# EAGLE design pcb_schematic (EAGLE 7.5.0)
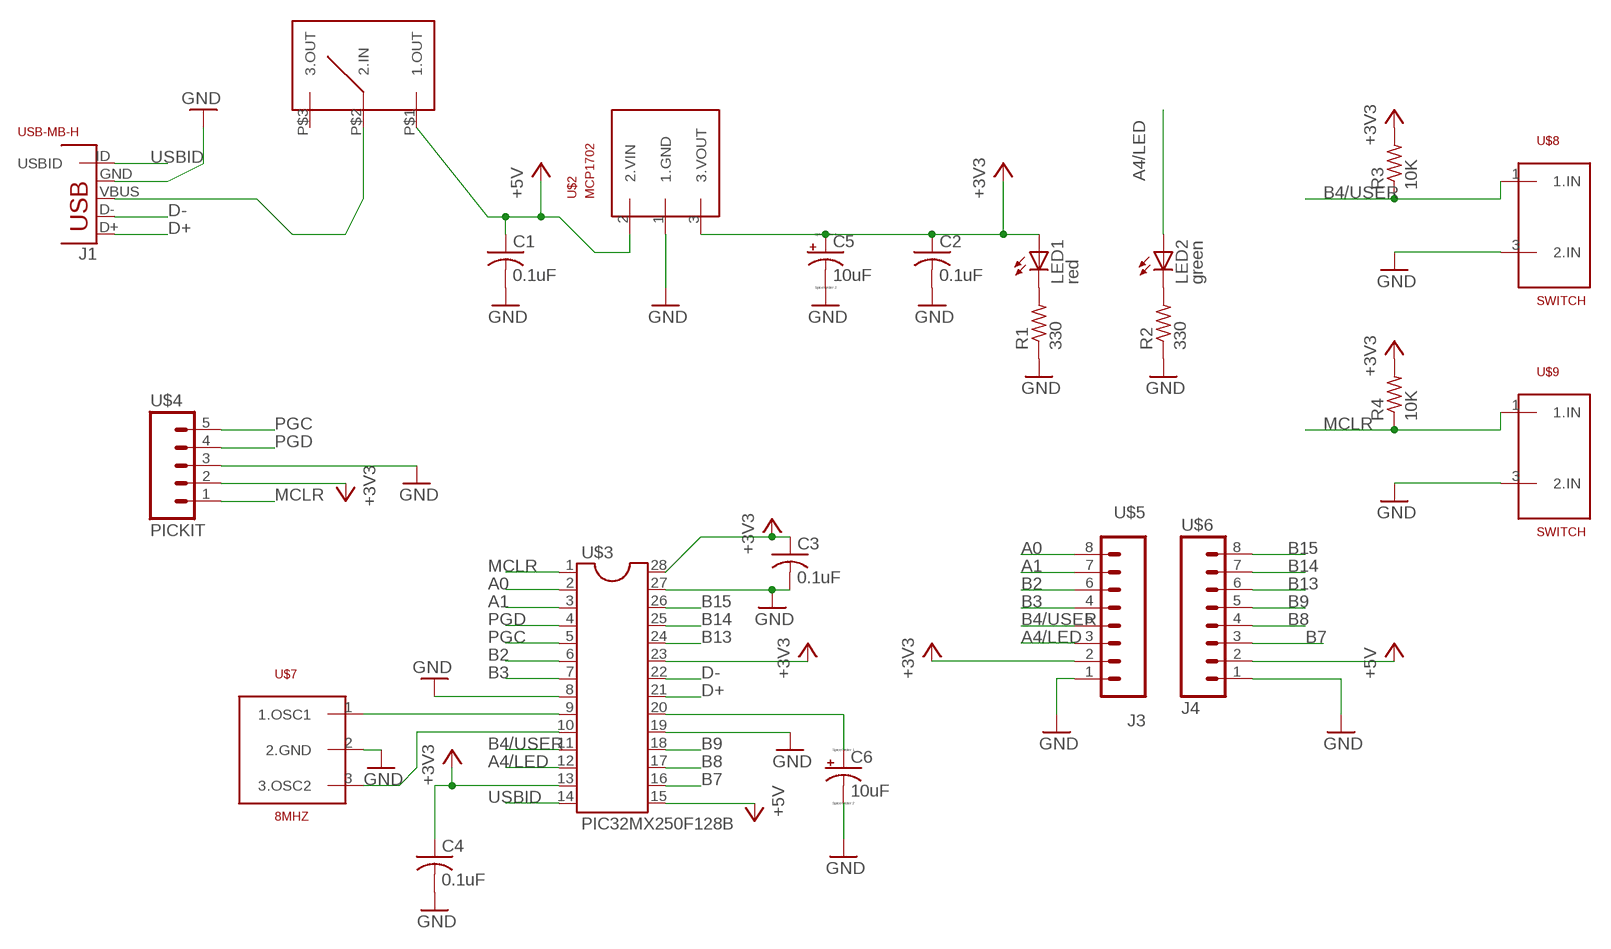
[diagram p0: schematic, sheet 1]

## Parts
C1  0.1uF  C-US025-025X050  [C025-025X050]
C2  0.1uF  C-US025-025X050  [C025-025X050]
C3  0.1uF  C-US025-025X050  [C025-025X050]
C4  0.1uF  C-US025-025X050  [C025-025X050]
C5  10uF  CPOL-USB45181A  [B45181A]
C6  10uF  CPOL-USB45181A  [B45181A]
J1  USB-MB-H  [USB-MB-H]
LED1  red  LED3MM  [LED3MM]
LED2  green  LED3MM  [LED3MM]
R1  330  R-US_0204/7  [0204/7]
R2  330  R-US_0204/7  [0204/7]
R3  10K  R-US_0204/7  [0204/7]
R4  10K  R-US_0204/7  [0204/7]
U$1  SLIDE_SWITCH  [SLIDE_SWITCH]
U$2  MCP1702  [TO92]
U$3  PIC32MX250F128B  [PIC32MX250F128B]
U$4  PICKIT  [PICKIT]
U$5  J3  [J3]
U$6  J4  [J4]
U$7  8MHZ  [8MHZ]
U$8  SWITCH  [SWITCH]
U$9  SWITCH  [SWITCH]

## Nets
+3V3: C2.1 C3.1 C4.1 C5.+ LED1.A R3.2 R4.2 U$2.3(3.VOUT) U$3.13(13.VDD) U$3.23(23.VUSB3V3) U$3.28(28.AVDD) U$4.2(2.3V3) U$5.2(2.3V3)
+5V: C1.1 U$1.P$1(1.OUT) U$2.2(2.VIN) U$3.15(15.VBUS) U$6.2(2.5V)
A0: U$3.2(2.A0) U$5.8(8.A0)
A1: U$3.3(3.A1) U$5.7(7.A1)
A4/LED: LED2.A U$3.12(12.A4/LED) U$5.3(3.A4/LED)
B2: U$3.6(6.B2) U$5.6(5.B3)
B3: U$3.7(7.B3) U$5.4(4.B4/USER)
B4/USER: R3.1 U$3.11(11.B4/USER) U$5.5 U$8.1(1.IN)
B7: U$3.16(16.B7) U$6.3(3.B7)
B8: U$3.17(17.B8) U$6.4(4.B8)
B9: U$3.18(18.B9) U$6.5(5.B9)
B13: U$3.24(24.B13) U$6.6(6.B13)
B14: U$3.25(25.B14) U$6.7(7.B14)
B15: U$3.26(26.B15) U$6.8(8.B15)
D+: J1.D+ U$3.21(21.D+/B10)
D-: J1.D- U$3.22(22.D-/B11)
GND: C1.2 C2.2 C3.2 C4.2 C5.- C6.- J1.GND R1.1 R2.1 U$2.1(1.GND) U$3.8(8.GND) U$3.19(19.VSS) U$3.27(27.AVSS) U$4.3(3.GND) U$5.1(1.GND) U$6.1(1.GND) U$7.2(2.GND) U$8.3(2.IN) U$9.3(2.IN)
MCLR: R4.1 U$3.1(1.MCLR) U$4.1(1.MCLR) U$9.1(1.IN)
N$1: J1.VBUS U$1.P$2(2.IN)
N$2: LED1.K(C) R1.2
N$3: LED2.K(C) R2.2
N$4: U$3.9(9.OSC1) U$7.1(1.OSC1)
N$5: U$3.10(10.OSC2) U$7.3(3.OSC2)
N$14: C6.+ U$3.20(20.VCAP)
PGC: U$3.5(5.PGC) U$4.5(5.PGC)
PGD: U$3.4(4.PGD) U$4.4(4.PGD)
USBID: J1.ID(USBID) U$3.14(14.USBID/B5)
Unconnected: U$1.P$3(3.OUT)

## Library data of the parts
C1-C4 = pcb_library:C-US: CAPACITOR, American symbol
C5 C6 = pcb_library:CPOL-US: POLARIZED CAPACITOR, American symbol
J1 = pcb_library:USB: USB Connectors USB-B-PTH is fully proven SKU : PRT-00139/CONN-08278 USB-miniB is fully proven SKU : PRT-00587 USB-A-PCB is untested. USB-A-H is throughly reviewed, but untested. Spark Fun Electronics SKU : PRT-00437 USB-B-SMT is throughly reviewed, but untested. Needs silkscreen touching up. USB-A-S has not been used/tested USB-MB-H has not been used/tested USB-MICROB has been used. CONN-09505
LED1 LED2 = pcb_library:LED: LED OSRAM: - CHIPLED LG R971, LG N971, LY N971, LG Q971, LY Q971, LO R971, LY R971 LH N974, LH R974 LS Q976, LO Q976, LY Q976 LO Q996 - Hyper CHIPLED LW Q18S LB Q993, LB Q99A, LB R99A - SideLED LS A670, LO A670, LY A670, LG A670, LP A670 LB A673, LV A673, LT A673, LW A673 LH A674 LY A675 LS A676, LA A676, LO A676, LY A676, LW A676 LS A679, LY A679, LG A679 - Hyper Micro SIDELED® LS Y876, LA Y876, LO Y876, LY Y876 LT Y87S - SmartLED LW L88C, LW L88S LB L89C, LB L89S, LG L890 LS L89K, LO L89K, LY L89K LS L896, LA L896, LO L896, LY L896 - TOPLED LS T670, LO T670, LY T670, LG T670, LP T670 LSG T670, LSP T670, LSY T670, LOP T670, LYG T670 LG T671, LOG T671, LSG T671 LB T673, LV T673, LT T673, LW T673 LH T674 LS T676, LA T676, LO T676, LY T676, LB T676, LH T676, LSB T676, LW T676 LB T67C, LV T67C, LT T67C, LS T67K, LO T67K, LY T67K, LW E67C LS E67B, LA E67B, LO E67B, LY E67B, LB E67C, LV E67C, LT E67C LW T67C LS T679, LY T679, LG T679 LS T770, LO T770, LY T770, LG T770, LP T770 LB T773, LV T773, LT T773, LW T773 LH T774 LS E675, LA E675, LY E675, LS T675 LS T776, LA T776, LO T776, LY T776, LB T776 LHGB T686 LT T68C, LB T68C - Hyper Mini TOPLED® LB M676 - Mini TOPLED Santana® LG M470 LS M47K, LO M47K, LY M47K Source: http://www.osram.convergy.de LUXEON: - LUMILED® LXK2-PW12-R00, LXK2-PW12-S00, LXK2-PW14-U00, LXK2-PW14-V00 LXK2-PM12-R00, LXK2-PM12-S00, LXK2-PM14-U00 LXK2-PE12-Q00, LXK2-PE12-R00, LXK2-PE12-S00, LXK2-PE14-T00, LXK2-PE14-U00 LXK2-PB12-K00, LXK2-PB12-L00, LXK2-PB12-M00, LXK2-PB14-N00, LXK2-PB14-P00, LXK2-PB14-Q00 LXK2-PR12-L00, LXK2-PR12-M00, LXK2-PR14-Q00, LXK2-PR14-R00 LXK2-PD12-Q00, LXK2-PD12-R00, LXK2-PD12-S00 LXK2-PH12-R00, LXK2-PH12-S00 LXK2-PL12-P00, LXK2-PL12-Q00, LXK2-PL12-R00 Source: www.luxeon.com KINGBRIGHT: KA-3528ASYC Source: www.kingbright.com
R1-R4 = pcb_library:R-US_: RESISTOR, American symbol
U$1 = pcb_library:SLIDE_SWITCH
U$2 = pcb_library:MCP1702
U$3 = pcb_library:PIC32MX250F128B
U$4 = pcb_library:PICKIT
U$5 = pcb_library:J3
U$6 = pcb_library:J4
U$7 = pcb_library:8MHZ
U$8 U$9 = pcb_library:SWITCH

## Board
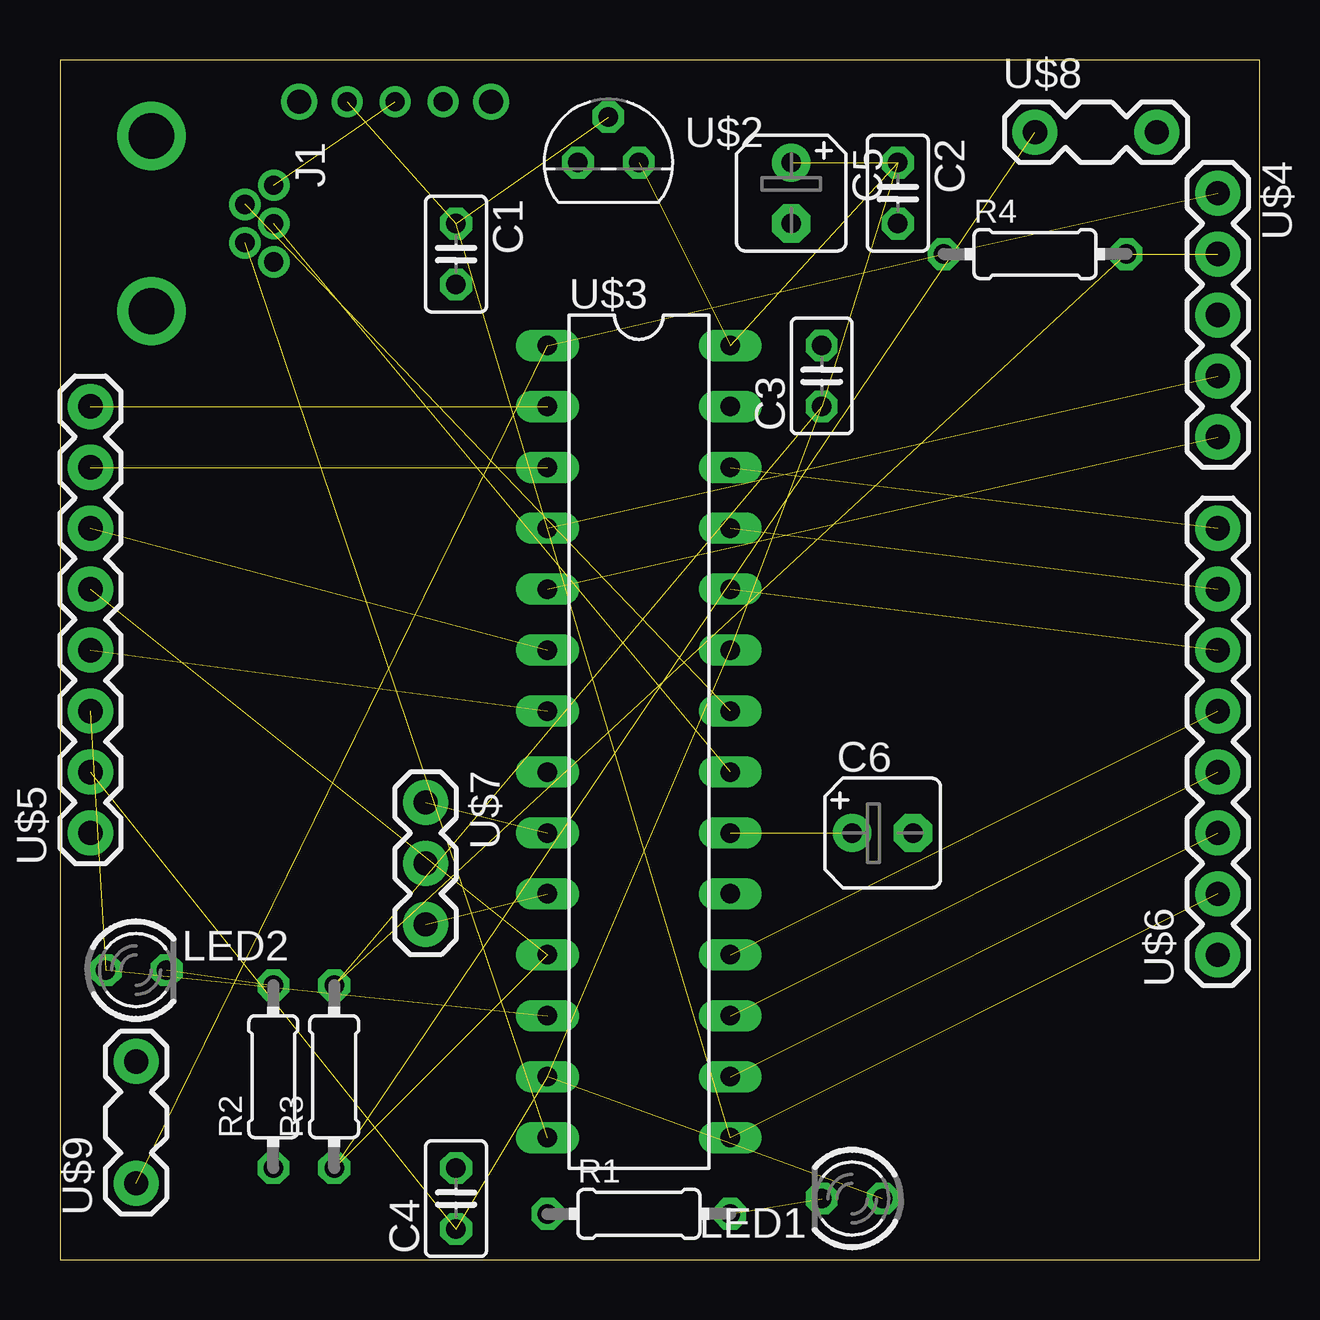
[diagram p1: board, top side]
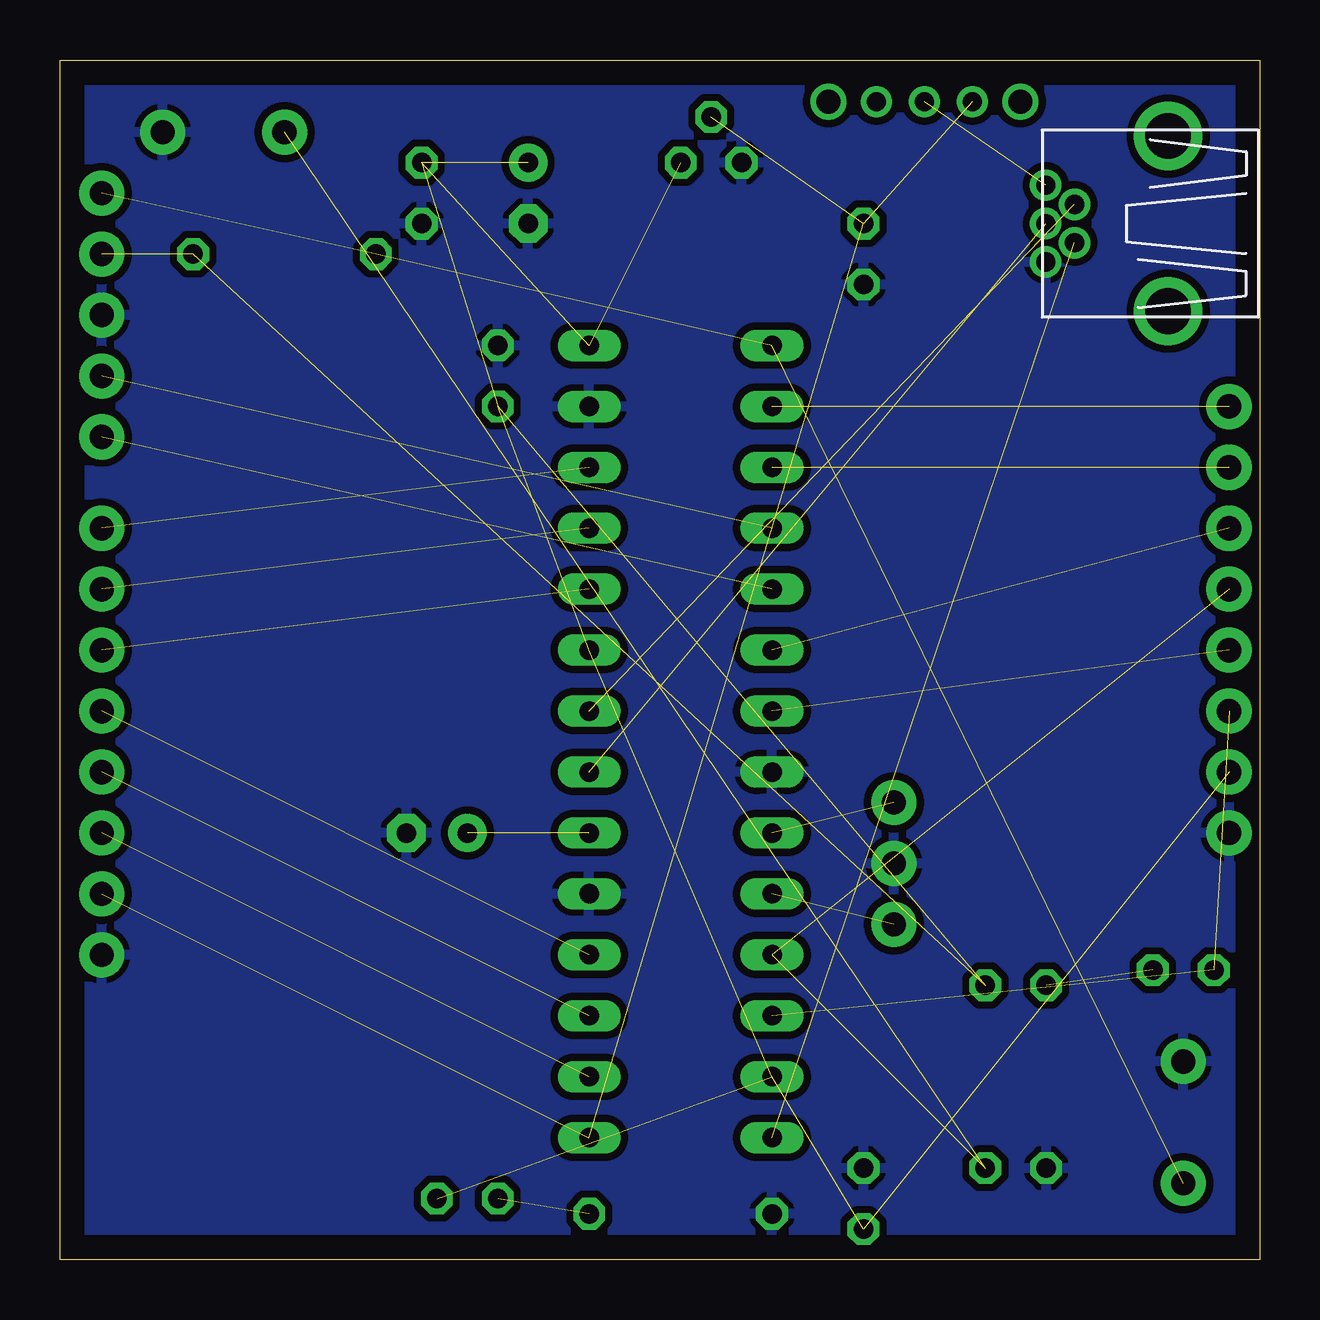
[diagram p2: board, bottom side, seen from below]

Size 50 x 50 mm. Coordinates in mm from the lower left corner, seen from the top.
Outline: 0,0 50,0 50,50 0,50 0,0
Copper layers (1*16): Top 0.035mm / dielectric 1.5mm / Bottom 0.035mm
Design rules "default": minimum track width 10mil, minimum drill 24mil, track to track 8mil, track to pad 8mil, pad to pad 8mil, via to via 8mil, smd to smd 8mil, copper to edge 40mil, drill to drill 8mil, minimum pad ring 10mil, minimum via ring 8mil, stop-mask expansion 4mil, vias tented up to drill 0mil, thermal gap 10mil

### Footprints (pad centres in the part's own frame; a part is rotated, then mirrored left to right if it is on the bottom)
C025-025X050 = drill 0.813 octagon: 1 -1.27,0; 2 1.27,0
B45181A = drill 0.813 pad 1.6: + -1.27,0 | drill 0.813 pad 1.6 octagon: - 1.27,0
USB-MB-H = drill 0.8: D+ 5.1,0; D- 3.9,0.8; GND 5.1,-1.6; ID 3.9,-0.8; VBUS 5.1,1.6 | drill 1.9: P$6 0,-3.65; P$7 0,3.65
LED3MM = drill 0.813 octagon: A -1.27,0; K 1.27,0
0204/7 = drill 0.813 octagon: 1 -3.81,0; 2 3.81,0
SLIDE_SWITCH = drill 0.8: P$1 -2,0; P$2 0,0; P$3 2,0 | drill 1: P$4 -4,0; P$5 4,0
TO92 = drill 0.813 octagon: 1 -1.27,0; 2 0,1.905; 3 1.27,0
PIC32MX250F128B = drill 0.813 long: 1 -16.51,-3.81; 2 -13.97,-3.81; 3 -11.43,-3.81; 4 -8.89,-3.81; 5 -6.35,-3.81; 6 -3.81,-3.81; 7 -1.27,-3.81; 8 1.27,-3.81; 9 3.81,-3.81; 10 6.35,-3.81; 11 8.89,-3.81; 12 11.43,-3.81; 13 13.97,-3.81; 14 16.51,-3.81; 15 16.51,3.81; 16 13.97,3.81; 17 11.43,3.81; 18 8.89,3.81; 19 6.35,3.81; 20 3.81,3.81; 21 1.27,3.81; 22 -1.27,3.81; 23 -3.81,3.81; 24 -6.35,3.81; 25 -8.89,3.81; 26 -11.43,3.81; 27 -13.97,3.81; 28 -16.51,3.81
PICKIT = drill 1.016 pad 1.88: 1 0,0; 2 2.54,0; 3 5.08,0; 4 7.62,0; 5 10.16,0
J3 = drill 1.016 pad 1.88: 1 0,0; 2 2.54,0; 3 5.08,0; 4 7.62,0; 5 10.16,0; 6 12.7,0; 7 15.24,0; 8 17.78,0
J4 = drill 1.016 pad 1.88: 1 0,0; 2 2.54,0; 3 5.08,0; 4 7.62,0; 5 10.16,0; 6 12.7,0; 7 15.24,0; 8 17.78,0
8MHZ = drill 1.016 pad 1.88: 1 0,0; 2 2.54,0; 3 5.08,0
SWITCH = drill 1.016 pad 1.88: 1 0,0; 3 5.08,0

### Placement (x,y rotation side)
C1  16.51,41.91 270 top
C2  34.92,44.45 270 top
C3  31.75,36.83 90 top
C4  16.51,2.54 90 top
C5  30.48,44.45 270 top
C6  34.29,17.78 0 top
J1  3.81,43.18 0 top
LED1  33.02,2.54 180 top
LED2  3.17,12.06 0 top
R1  24.13,1.91 0 top
R2  8.89,7.62 90 top
R3  11.43,7.62 90 top
R4  40.64,41.91 0 top
U$1  13.97,48.26 0 top
U$2  22.86,45.72 0 top
U$3  24.13,21.59 270 top
U$4  48.26,44.45 270 top
U$5  1.27,17.78 90 top
U$6  48.26,12.7 90 top
U$7  15.24,19.05 270 top
U$8  40.64,46.99 0 top
U$9  3.17,3.17 90 top

### Tracks (layer width: path | path; a pad name or v marks a point on that pad's centre or on a via)
+3V3  (12 unrouted)
+5V  (4 unrouted)
A0  (1 unrouted)
A1  (1 unrouted)
A4/LED  (2 unrouted)
B2  (1 unrouted)
B3  (1 unrouted)
B4/USER  (3 unrouted)
B7  (1 unrouted)
B8  (1 unrouted)
B9  (1 unrouted)
B13  (1 unrouted)
B14  (1 unrouted)
B15  (1 unrouted)
D+  (1 unrouted)
D-  (1 unrouted)
GND
  pour Bottom (isolate 0.305): 0.64,49.53 49.53,49.53 49.53,0.64 0.64,0.64
MCLR  (3 unrouted)
N$1  (1 unrouted)
N$2  (1 unrouted)
N$3  (1 unrouted)
N$4  (1 unrouted)
N$5  (1 unrouted)
N$14  (1 unrouted)
PGC  (1 unrouted)
PGD  (1 unrouted)
USBID  (1 unrouted)